# Altium schematic sheet [09] - Ethernet.SchDoc
size A3
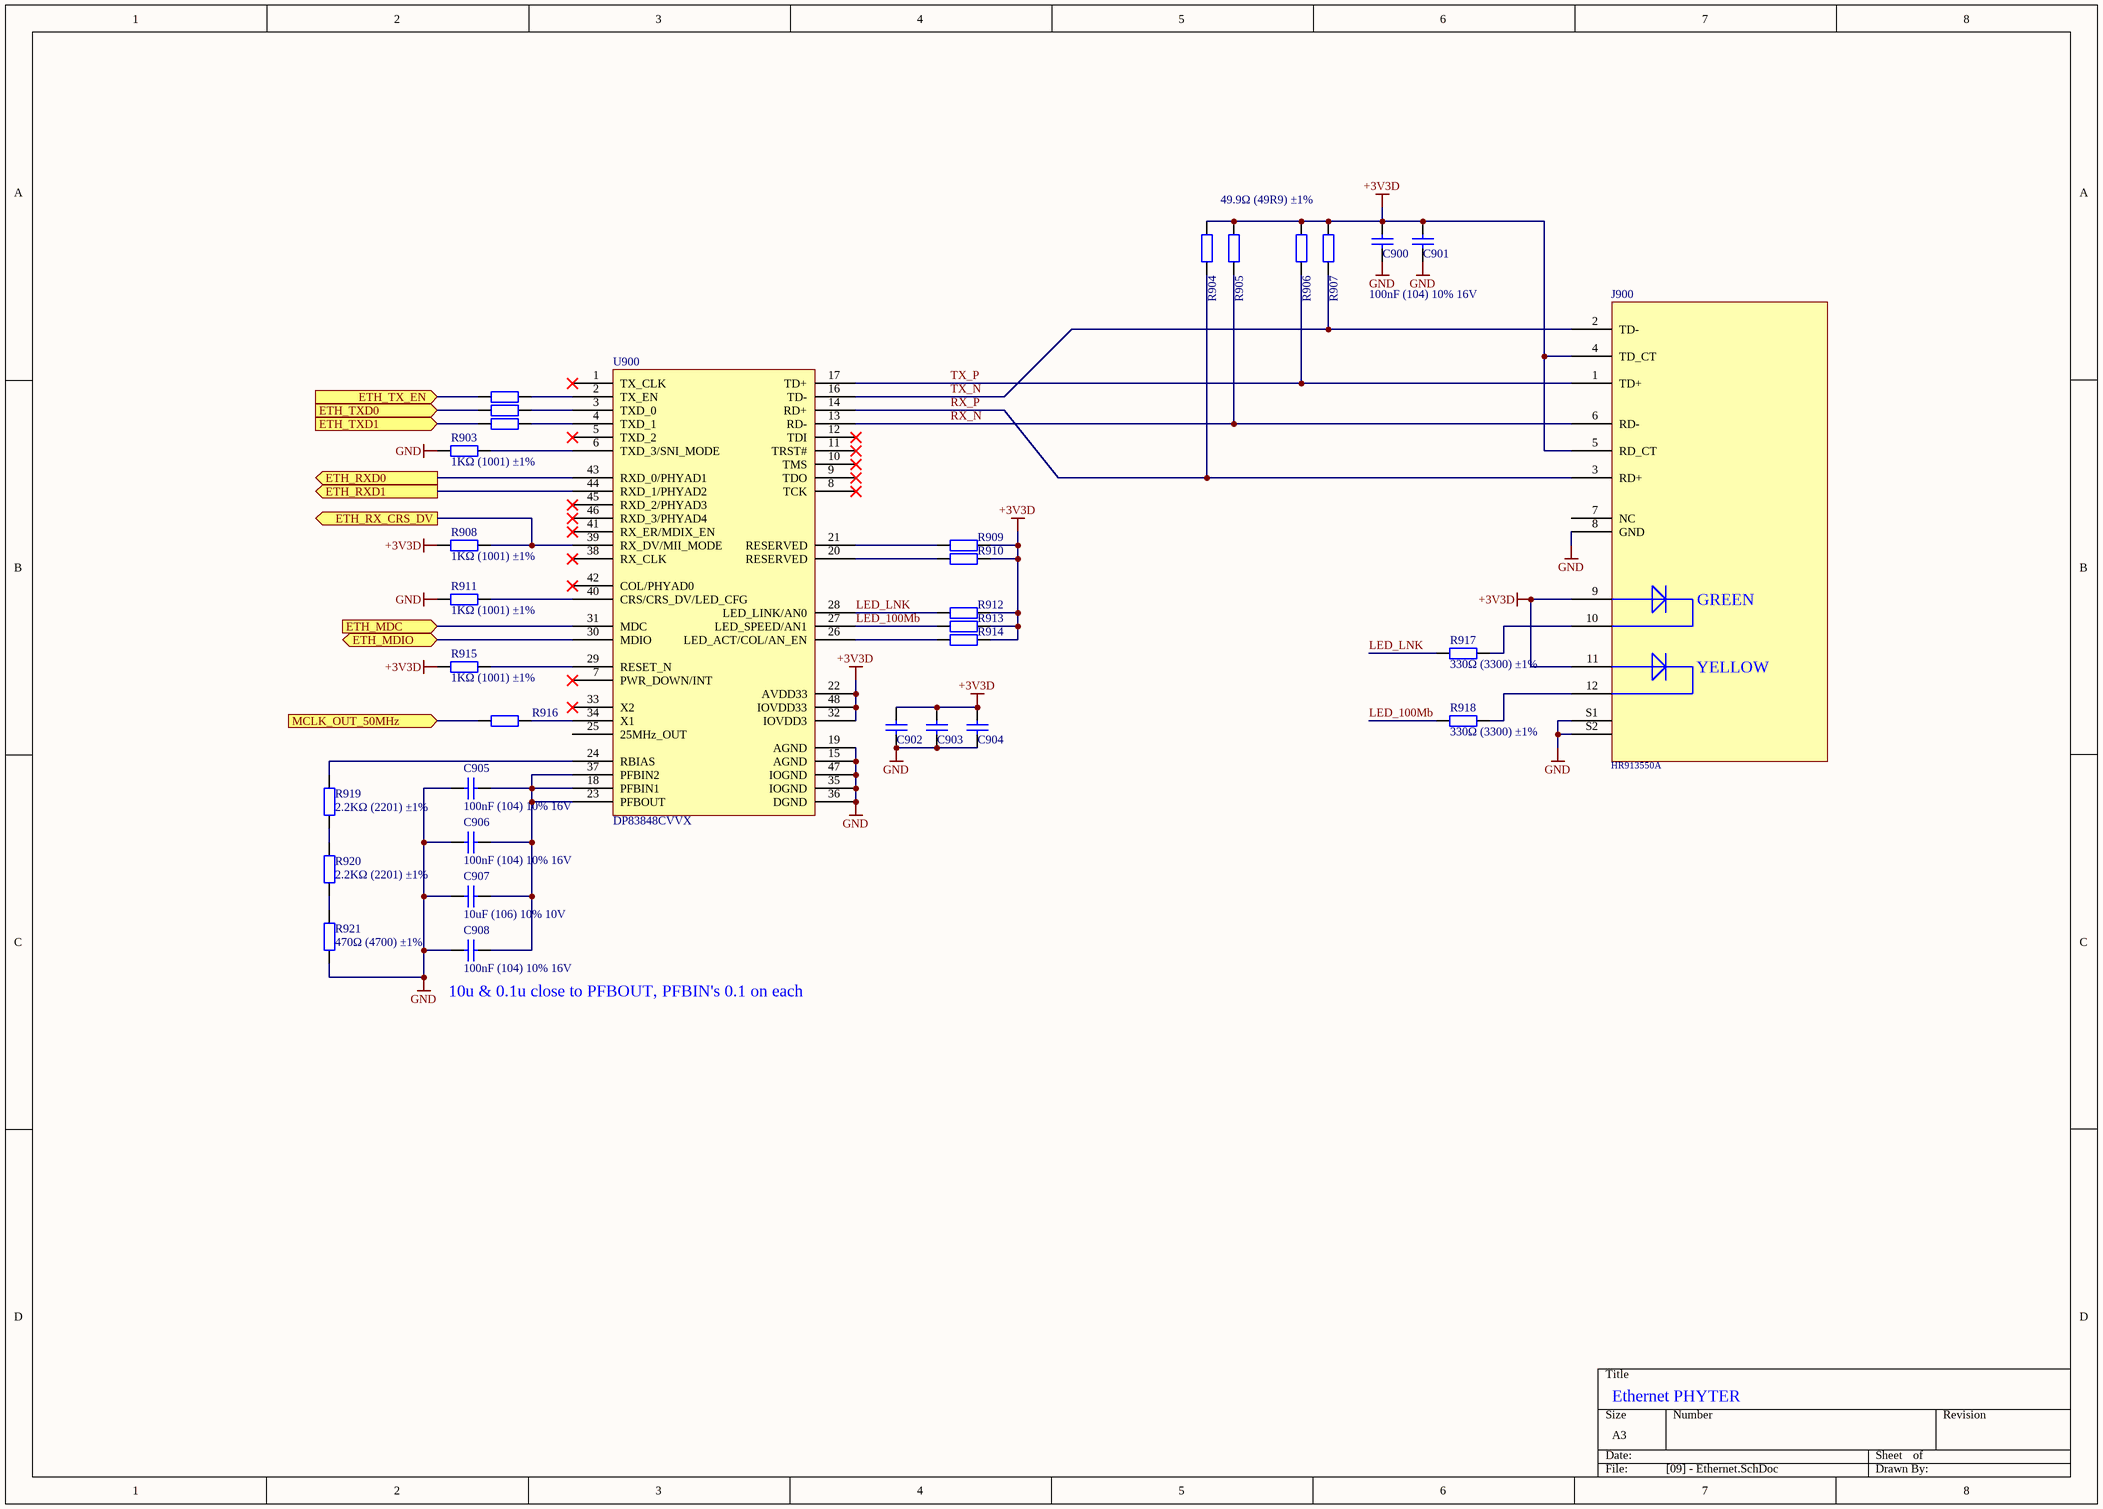
[diagram p0: [09] - Ethernet.SchDoc]

## Parts
C900  100nF (104) 10% 16V  [0402_C]
C901  100nF (104) 10% 16V  [0402_C]  (value not drawn)
C902  100nF (104) 10% 16V  [0402_C]  (value not drawn)
C903  100nF (104) 10% 16V  [0402_C]  (value not drawn)
C904  100nF (104) 10% 16V  [0402_C]  (value not drawn)
C905  100nF (104) 10% 16V  [0402_C]
C906  100nF (104) 10% 16V  [0402_C]
C907  10uF (106) 10% 10V  [0603_C]
C908  100nF (104) 10% 16V  [0402_C]
J900  HR913550A  [RJ45 MagJack]
R900  49.9Ω (49R9) ±1%  [0402_R]  (value not drawn)
R901  49.9Ω (49R9) ±1%  [0402_R]  (value not drawn)
R902  49.9Ω (49R9) ±1%  [0402_R]  (value not drawn)
R903  1KΩ (1001) ±1%  [0402_R]
R904  49.9Ω (49R9) ±1%  [0402_R]  (value not drawn)
R905  49.9Ω (49R9) ±1%  [0402_R]  (value not drawn)
R906  49.9Ω (49R9) ±1%  [0402_R]  (value not drawn)
R907  49.9Ω (49R9) ±1%  [0402_R]
R908  1KΩ (1001) ±1%  [0402_R]
R909  2.2KΩ (2201) ±1%  [0402_R]  (value not drawn)
R910  2.2KΩ (2201) ±1%  [0402_R]  (value not drawn)
R911  1KΩ (1001) ±1%  [0402_R]
R912  2.2KΩ (2201) ±1%  [0402_R]  (value not drawn)
R913  2.2KΩ (2201) ±1%  [0402_R]  (value not drawn)
R914  2.2KΩ (2201) ±1%  [0402_R]  (value not drawn)
R915  1KΩ (1001) ±1%  [0402_R]
R916  49.9Ω (49R9) ±1%  [0402_R]  (value not drawn)
R917  330Ω (3300) ±1%  [0603_R]
R918  330Ω (3300) ±1%  [0603_R]
R919  2.2KΩ (2201) ±1%  [0402_R]
R920  2.2KΩ (2201) ±1%  [0402_R]
R921  470Ω (4700) ±1%  [0402_R]
U900  DP83848CVVX  [LQFP-48_7x7x05P]

## Ports
ETH_MDC (in), ETH_MDIO (bidir), ETH_RX_CRS_DV (out), ETH_RXD0 (out), ETH_RXD1 (out), ETH_TX_EN (in), ETH_TXD0 (in), ETH_TXD1 (in), MCLK_OUT_50MHz (in)

## Nets
+3V3D: C900.2 C901.2 C902.2 C903.2 C904.2 J900.4(TD_CT) J900.5(RD_CT) J900.9 J900.11 R904.2 R905.2 R906.2 R907.2 R908.1 R909.2 R910.2 R912.2 R913.2 R914.2 R915.1 U900.22(AVDD33) U900.32(IOVDD3) U900.48(IOVDD33)
GND: C900.1 C901.1 C902.1 C903.1 C904.1 C905.1 C906.1 C907.1 C908.1 J900.8(GND) J900.S1 J900.S2 R903.1 R911.1 R921.1 U900.15(AGND) U900.19(AGND) U900.35(IOGND) U900.36(DGND) U900.47(IOGND)
ETH_MDC: U900.31(MDC) ; port ETH_MDC
ETH_MDIO: U900.30(MDIO) ; port ETH_MDIO
ETH_RX_CRS_DV: R908.2 U900.39(RX_DV/MII_MODE) ; port ETH_RX_CRS_DV
ETH_RXD0: U900.43(RXD_0/PHYAD1) ; port ETH_RXD0
ETH_RXD1: U900.44(RXD_1/PHYAD2) ; port ETH_RXD1
ETH_TX_EN: R900.1 ; port ETH_TX_EN
ETH_TXD0: R901.1 ; port ETH_TXD0
ETH_TXD1: R902.1 ; port ETH_TXD1
LED_100Mb: R913.1 R918.1 U900.27(LED_SPEED/AN1)
LED_LNK: R912.1 R917.1 U900.28(LED_LINK/AN0)
MCLK_OUT_50MHz: R916.1 ; port MCLK_OUT_50MHz
RX_N: J900.6(RD-) R905.1 U900.13(RD-)
RX_P: J900.3(RD+) R904.1 U900.14(RD+)
TX_N: J900.2(TD-) R907.1 U900.16(TD-)
TX_P: J900.1(TD+) R906.1 U900.17(TD+)
NetC905_2: C905.2 C906.2 C907.2 C908.2 U900.18(PFBIN1) U900.23(PFBOUT) U900.37(PFBIN2)
NetJ900_10: J900.10 R917.2
NetJ900_12: J900.12 R918.2
NetR900_2: R900.2 U900.2(TX_EN)
NetR901_2: R901.2 U900.3(TXD_0)
NetR902_2: R902.2 U900.4(TXD_1)
NetR903_2: R903.2 U900.6(TXD_3/SNI_MODE)
NetR909_1: R909.1 U900.21(RESERVED)
NetR910_1: R910.1 U900.20(RESERVED)
NetR911_2: R911.2 U900.40(CRS/CRS_DV/LED_CFG)
NetR914_1: R914.1 U900.26(LED_ACT/COL/AN_EN)
NetR915_2: R915.2 U900.29(RESET_N)
NetR916_2: R916.2 U900.34(X1)
NetR919_1: R919.1 R920.2
NetR919_2: R919.2 U900.24(RBIAS)
NetR920_1: R920.1 R921.2

Not connected (* = marked no-connect by the designer): J900 7(NC); U900 1(TX_CLK)* 5(TXD_2)* 7(PWR_DOWN/INT)* 8(TCK)* 9(TDO)* 10(TMS)* 11(TRST#)* 12(TDI)* 25(25MHz_OUT) 33(X2)* 38(RX_CLK)* 41(RX_ER/MDIX_EN)* 42(COL/PHYAD0)* 45(RXD_2/PHYAD3)* 46(RXD_3/PHYAD4)*

## Notes on the sheet
- (near C908) 10u & 0.1u close to PFBOUT, PFBIN's 0.1 on each
- Ethernet PHYTER
- (in symbol HR913550A) GREEN; YELLOW

## Library data of the parts
C900-C906 C908 = 0402 100nF (104) 10% 16V: 贴片电容; ComponentLink1Description: 供应商链接; ComponentLink1URL: http://www.szlcsc.com/product/details_1877.html; Package: 0402; Supplier: LC; SuppliersPartNumber: C1525
C907 = 0603 10uF (106) 10% 10V: 贴片电容; ComponentLink1Description: 供应商链接; ComponentLink1URL: http://www.szlcsc.com/product/details_20411.html; Package: 0603; Supplier: LC; SuppliersPartNumber: C19702
J900 = HR913550A: RJ45 12 1 Green - Yellow Through Hole Ethernet Connectors/Modular Connectors (RJ45 RJ11) RoHS; JLCPCB: NO; SuppliersPartNumber: C163507
R900-R902 R904-R907 R916 = 0402 49.9Ω (49R9) 1%: 贴片电阻; ComponentLink1Description: 供应商链接; ComponentLink1URL: http://www.szlcsc.com/product/details_25863.html; Package: 0402; Supplier: LC; SuppliersPartNumber: C25120
R903 R908 R911 R915 = 0402 1KΩ (1001) 1%: 贴片电阻; ComponentLink1Description: 供应商链接; ComponentLink1URL: http://www.szlcsc.com/product/details_12256.html; Package: 0402; Supplier: LC; SuppliersPartNumber: C11702
R909 R910 R912-R914 R919 R920 = 0402 2.2KΩ (2201) 1%: 贴片电阻; ComponentLink1Description: 供应商链接; ComponentLink1URL: http://www.szlcsc.com/product/details_26622.html; Package: 0402; Supplier: LC; SuppliersPartNumber: C25879
R917 R918 = 0603 330Ω (3300) 1%: 贴片电阻; ComponentLink1Description: 供应商链接; ComponentLink1URL: http://www.szlcsc.com/product/details_23865.html; Package: 0603; Supplier: LC; SuppliersPartNumber: C23138
R921 = 0402 470Ω (4700) 1%: 贴片电阻; ComponentLink1Description: 供应商链接; ComponentLink1URL: http://www.szlcsc.com/product/details_25860.html; Package: 0402; Supplier: LC; SuppliersPartNumber: C25117
U900 = DP83848CVVX_[C16688]: 接口芯片; ComponentLink1Description: 供应商链接; ComponentLink1URL: http://www.szlcsc.com/product/details_17371.html; Package: LQFP-48_7x7x05P; Supplier: LC; SuppliersPartNumber: C16688